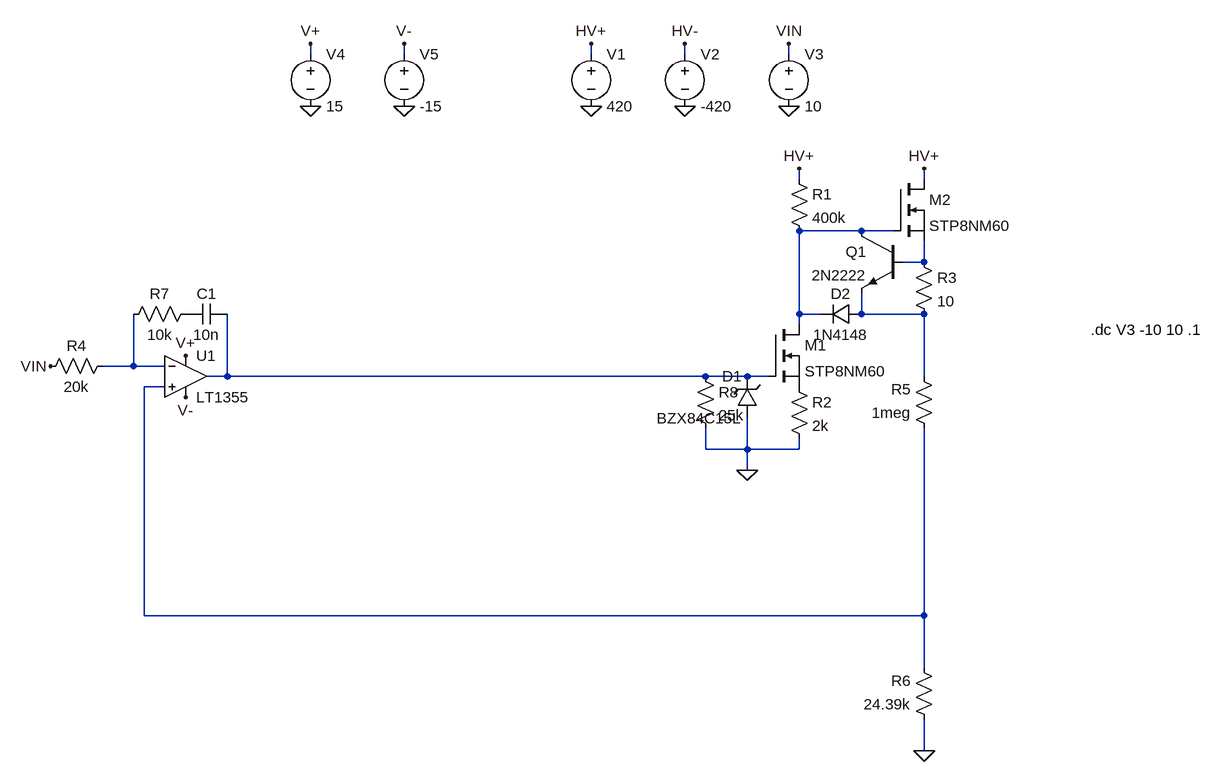
[diagram p0: schematic Draft10.asc]
Draft10.asc, the LTspice schematic file:
Version 4
SHEET 1 916 932
WIRE -544 -208 -544 -224
WIRE -400 -208 -400 -224
WIRE -112 -208 -112 -224
WIRE 32 -208 32 -224
WIRE 192 -208 192 -224
WIRE 208 -16 208 -32
WIRE 400 -16 400 -32
WIRE 304 64 208 64
WIRE 352 64 304 64
WIRE 400 112 400 80
WIRE 400 112 368 112
WIRE 208 192 208 64
WIRE 240 192 208 192
WIRE 304 192 304 160
WIRE 400 192 304 192
WIRE 208 208 208 192
WIRE -816 272 -816 192
WIRE -816 272 -864 272
WIRE -768 272 -816 272
WIRE -672 288 -672 192
WIRE -672 288 -704 288
WIRE 64 288 -672 288
WIRE 128 288 64 288
WIRE 160 288 128 288
WIRE 400 288 400 192
WIRE -768 304 -800 304
WIRE 64 400 64 368
WIRE 128 400 128 352
WIRE 128 400 64 400
WIRE 208 400 208 384
WIRE 208 400 128 400
WIRE 128 432 128 400
WIRE -800 656 -800 304
WIRE 400 656 400 368
WIRE 400 656 -800 656
WIRE 400 736 400 656
WIRE 400 864 400 816
FLAG -112 -128 0
FLAG 32 -128 0
FLAG 192 -128 0
FLAG -112 -224 HV+
FLAG 32 -224 HV-
FLAG 192 -224 VIN
FLAG 208 -32 HV+
FLAG 400 -32 HV+
FLAG -544 -128 0
FLAG -400 -128 0
FLAG -544 -224 V+
FLAG -400 -224 V-
FLAG -736 256 V+
FLAG -736 320 V-
FLAG -944 272 VIN
FLAG 400 864 0
FLAG 128 432 0
SYMBOL nmos 160 208 R0
SYMATTR InstName M1
SYMATTR Value STP8NM60
SYMBOL res 192 -32 R0
SYMATTR InstName R1
SYMATTR Value 400k
SYMBOL voltage -112 -224 R0
WINDOW 123 0 0 Left 2
WINDOW 39 0 0 Left 2
SYMATTR InstName V1
SYMATTR Value 420
SYMBOL voltage 32 -224 R0
WINDOW 123 0 0 Left 2
WINDOW 39 0 0 Left 2
SYMATTR InstName V2
SYMATTR Value -420
SYMBOL voltage 192 -224 R0
WINDOW 123 24 44 Left 2
WINDOW 39 0 0 Left 2
SYMATTR InstName V3
SYMATTR Value 10
SYMBOL res 192 288 R0
SYMATTR InstName R2
SYMATTR Value 2k
SYMBOL nmos 352 -16 R0
SYMATTR InstName M2
SYMATTR Value STP8NM60
SYMBOL diode 304 176 R90
WINDOW 0 0 32 VBottom 2
WINDOW 3 32 32 VTop 2
SYMATTR InstName D2
SYMATTR Value 1N4148
SYMBOL npn 368 64 M0
SYMATTR InstName Q1
SYMATTR Value 2N2222
SYMBOL res 384 96 R0
SYMATTR InstName R3
SYMATTR Value 10
SYMBOL voltage -544 -224 R0
WINDOW 123 0 0 Left 2
WINDOW 39 0 0 Left 2
SYMATTR InstName V4
SYMATTR Value 15
SYMBOL voltage -400 -224 R0
WINDOW 123 0 0 Left 2
WINDOW 39 0 0 Left 2
SYMATTR InstName V5
SYMATTR Value -15
SYMBOL Opamps\\LT1355 -736 224 R0
SYMATTR InstName U1
SYMBOL res -848 256 R90
WINDOW 0 0 56 VBottom 2
WINDOW 3 32 56 VTop 2
SYMATTR InstName R4
SYMATTR Value 20k
SYMBOL res 416 384 R180
WINDOW 0 36 76 Left 2
WINDOW 3 36 40 Left 2
SYMATTR InstName R5
SYMATTR Value 1meg
SYMBOL res 416 832 R180
WINDOW 0 36 76 Left 2
WINDOW 3 36 40 Left 2
SYMATTR InstName R6
SYMATTR Value 24.39k
SYMBOL res -720 176 R90
WINDOW 0 0 56 VBottom 2
WINDOW 3 32 56 VTop 2
SYMATTR InstName R7
SYMATTR Value 10k
SYMBOL cap -672 176 R90
WINDOW 0 0 32 VBottom 2
WINDOW 3 32 32 VTop 2
SYMATTR InstName C1
SYMATTR Value 10n
SYMBOL res 48 272 R0
SYMATTR InstName R8
SYMATTR Value 25k
SYMBOL zener 144 352 R180
WINDOW 0 24 64 Left 2
WINDOW 3 24 0 Left 2
SYMATTR InstName D1
SYMATTR Value BZX84C15L
SYMATTR Description Diode
SYMATTR Type diode
TEXT 656 216 Left 2 !.dc V3 -10 10 .1

The netlist it stands for:
* Draft10.asc
M1 N001 N005 P001 P001 STP8NM60
R1 HV+ N001 400k
V1 HV+ 0 420
V2 HV- 0 -420
V3 VIN 0 10
R2 P001 0 2k
M2 HV+ N001 N002 N002 STP8NM60
D2 N003 N001 1N4148
Q1 N001 N002 N003 0 2N2222
R3 N002 N003 10
V4 V+ 0 15
V5 V- 0 -15
XU1 N006 N004 V+ V- N005 LT1355  ; pins In+ In- V+ V- OUT
R4 N004 VIN 20k
R5 N006 N003 1meg
R6 0 N006 24.39k
R7 P002 N004 10k
C1 N005 P002 10n
R8 N005 0 25k
D1 0 N005 BZX84C15L
.model D D
.lib standard.dio
.model NPN NPN
.model PNP PNP
.lib standard.bjt
.model NMOS NMOS
.model PMOS PMOS
.lib standard.mos
.dc V3 -10 10 .1
.backanno
.end